# Altium project PROJECT NAME V1.1.PrjPcb
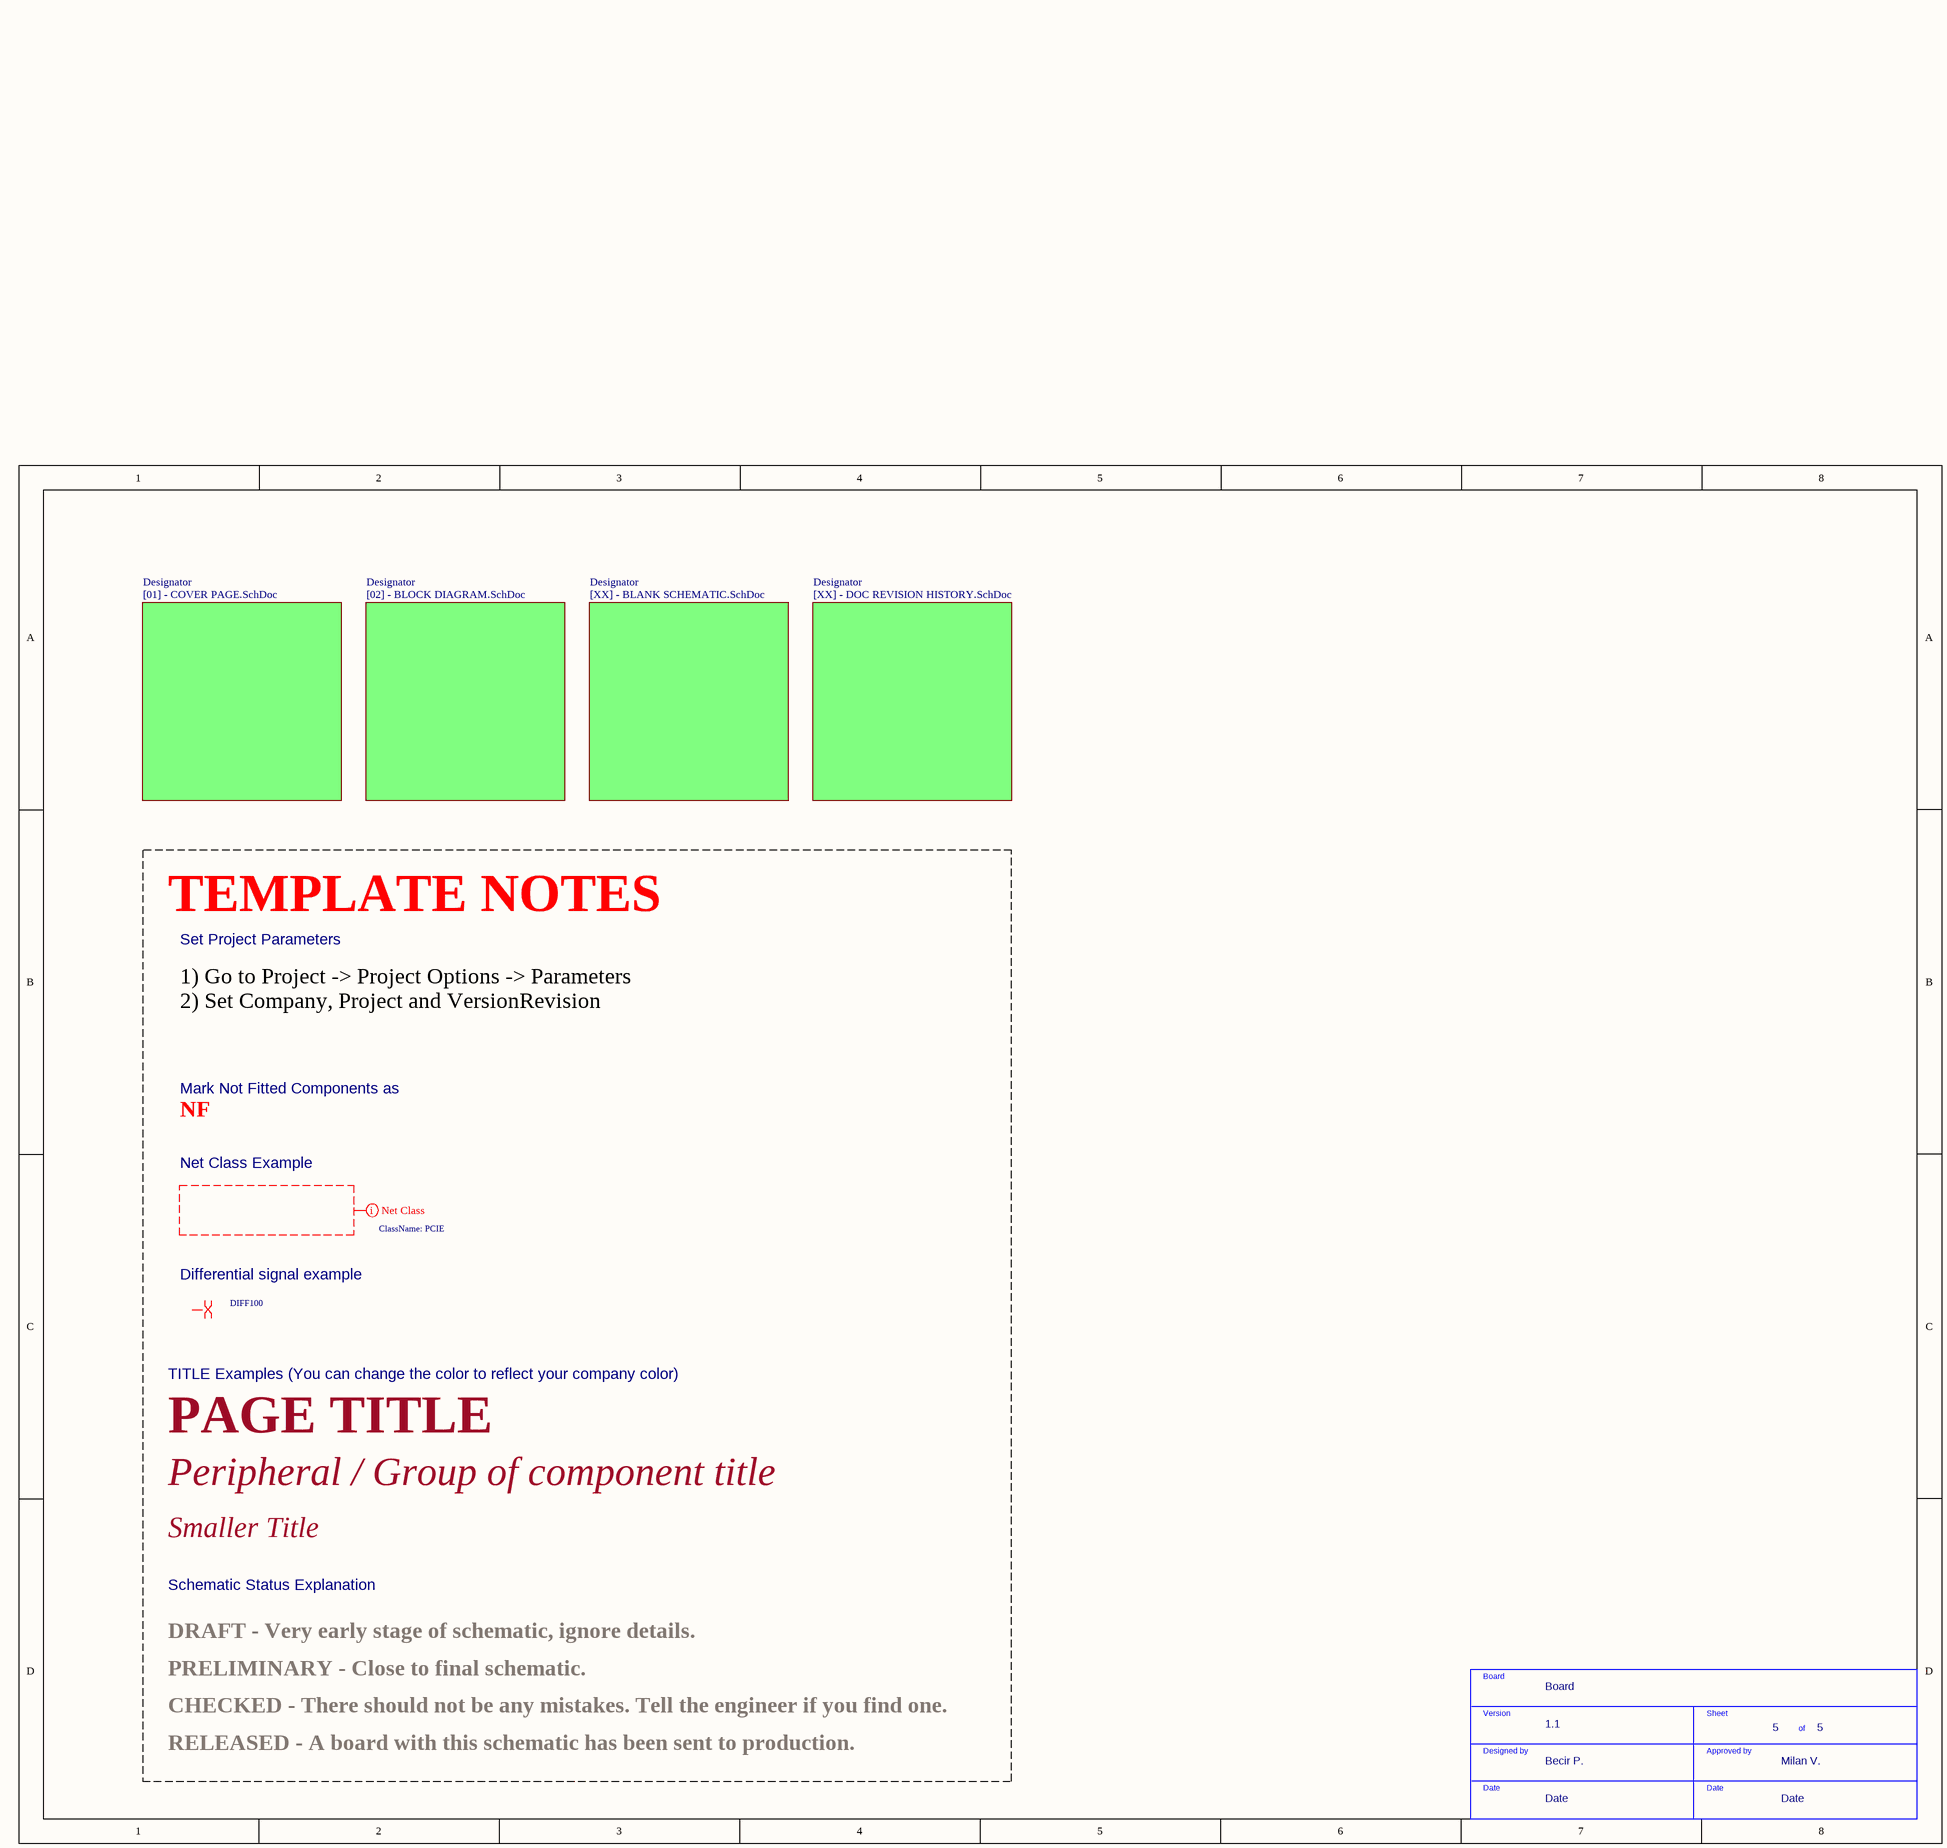
[diagram p0: PROJECT NAME.SchDoc]
Approved: Milan V.; ApprovedDate: Date; Board: Board; Company: IBEKO POWER AB; Designed: Becir P.; DesignedDate: Date; Project: PROJECT NAME; Title: PROJECT NAME V1.1; Version: 1.1
5 sheets, 6 parts. Net scope: global (net labels, ports and power ports of the same name join across sheets).
Board file: PROJECT NAME V1.1.PcbDoc
Sheets:
  PROJECT NAME.SchDoc
    Designator = [01] - COVER PAGE.SchDoc
    Designator = [02] - BLOCK DIAGRAM.SchDoc
    Designator = [XX] - BLANK SCHEMATIC.SchDoc
    Designator = [XX] - DOC REVISION HISTORY.SchDoc

## Sheet PROJECT NAME.SchDoc: PROJECT NAME V1.1
size A3; CompanyName: KDS; Organization: KDS; DocumentNumber: 5; Revision: V1I1; SheetNumber: 5; SheetTotal: 5; PageSetup: Record=PageOptions|CenterHorizontal=True|CenterVertical=True|PrintScale=1.07|XCorrection=1.00|YCorrection=1.00|PrintKind=1|BorderSize=5000000|LeftOffset=0|BottomOffset=0|Orientation=2|PaperLength=1000|PaperWidth=1000|Scale=100|PaperSource=7|PrintQuality=600|MediaType=1|DitherType=10|PaperKind=A3|PrintScaleMode=1; ProjectName: KDS C6A816x Module

### Parts
(Parts that share a designator on the sheet are numbered #1, #2 ... from top to bottom, then left to right.)
STB#1  -  (value not drawn)  (graphical)

### Sub-sheets
Designator = [01] - COVER PAGE.SchDoc: no entries
Designator = [02] - BLOCK DIAGRAM.SchDoc: no entries
Designator = [XX] - BLANK SCHEMATIC.SchDoc: no entries
Designator = [XX] - DOC REVISION HISTORY.SchDoc: no entries

### Layout directives
net class PCIE: (no net found under the mark)
differential pair; net class DIFF100: (no net found under the mark)

### Notes on the sheet
- TEMPLATE NOTES
- Set Project Parameters
- 1) Go to Project -> Project Options -> Parameters
  2) Set Company, Project and VersionRevision
- NF
- Mark Not Fitted Components as
- Net Class Example
- Differential signal example
- TITLE Examples (You can change the color to reflect your company color)
- PAGE TITLE
- Peripheral / Group of component title
- Smaller Title
- Schematic Status Explanation
- PRELIMINARY - Close to final schematic.
- DRAFT - Very early stage of schematic, ignore details.
- CHECKED - There should not be any mistakes. Tell the engineer if you find one.
- RELEASED - A board with this schematic has been sent to production.
- (in symbol Schematic Title Block) Board; Version; Sheet; of; Designed by; Approved by; Date

### Library data of the parts
STB#1 = Schematic Title Block

## Sheet [01] - COVER PAGE.SchDoc: PROJECT NAME V1.1
size A3; DocumentNumber: 1; SheetNumber: 1; SheetTotal: 5
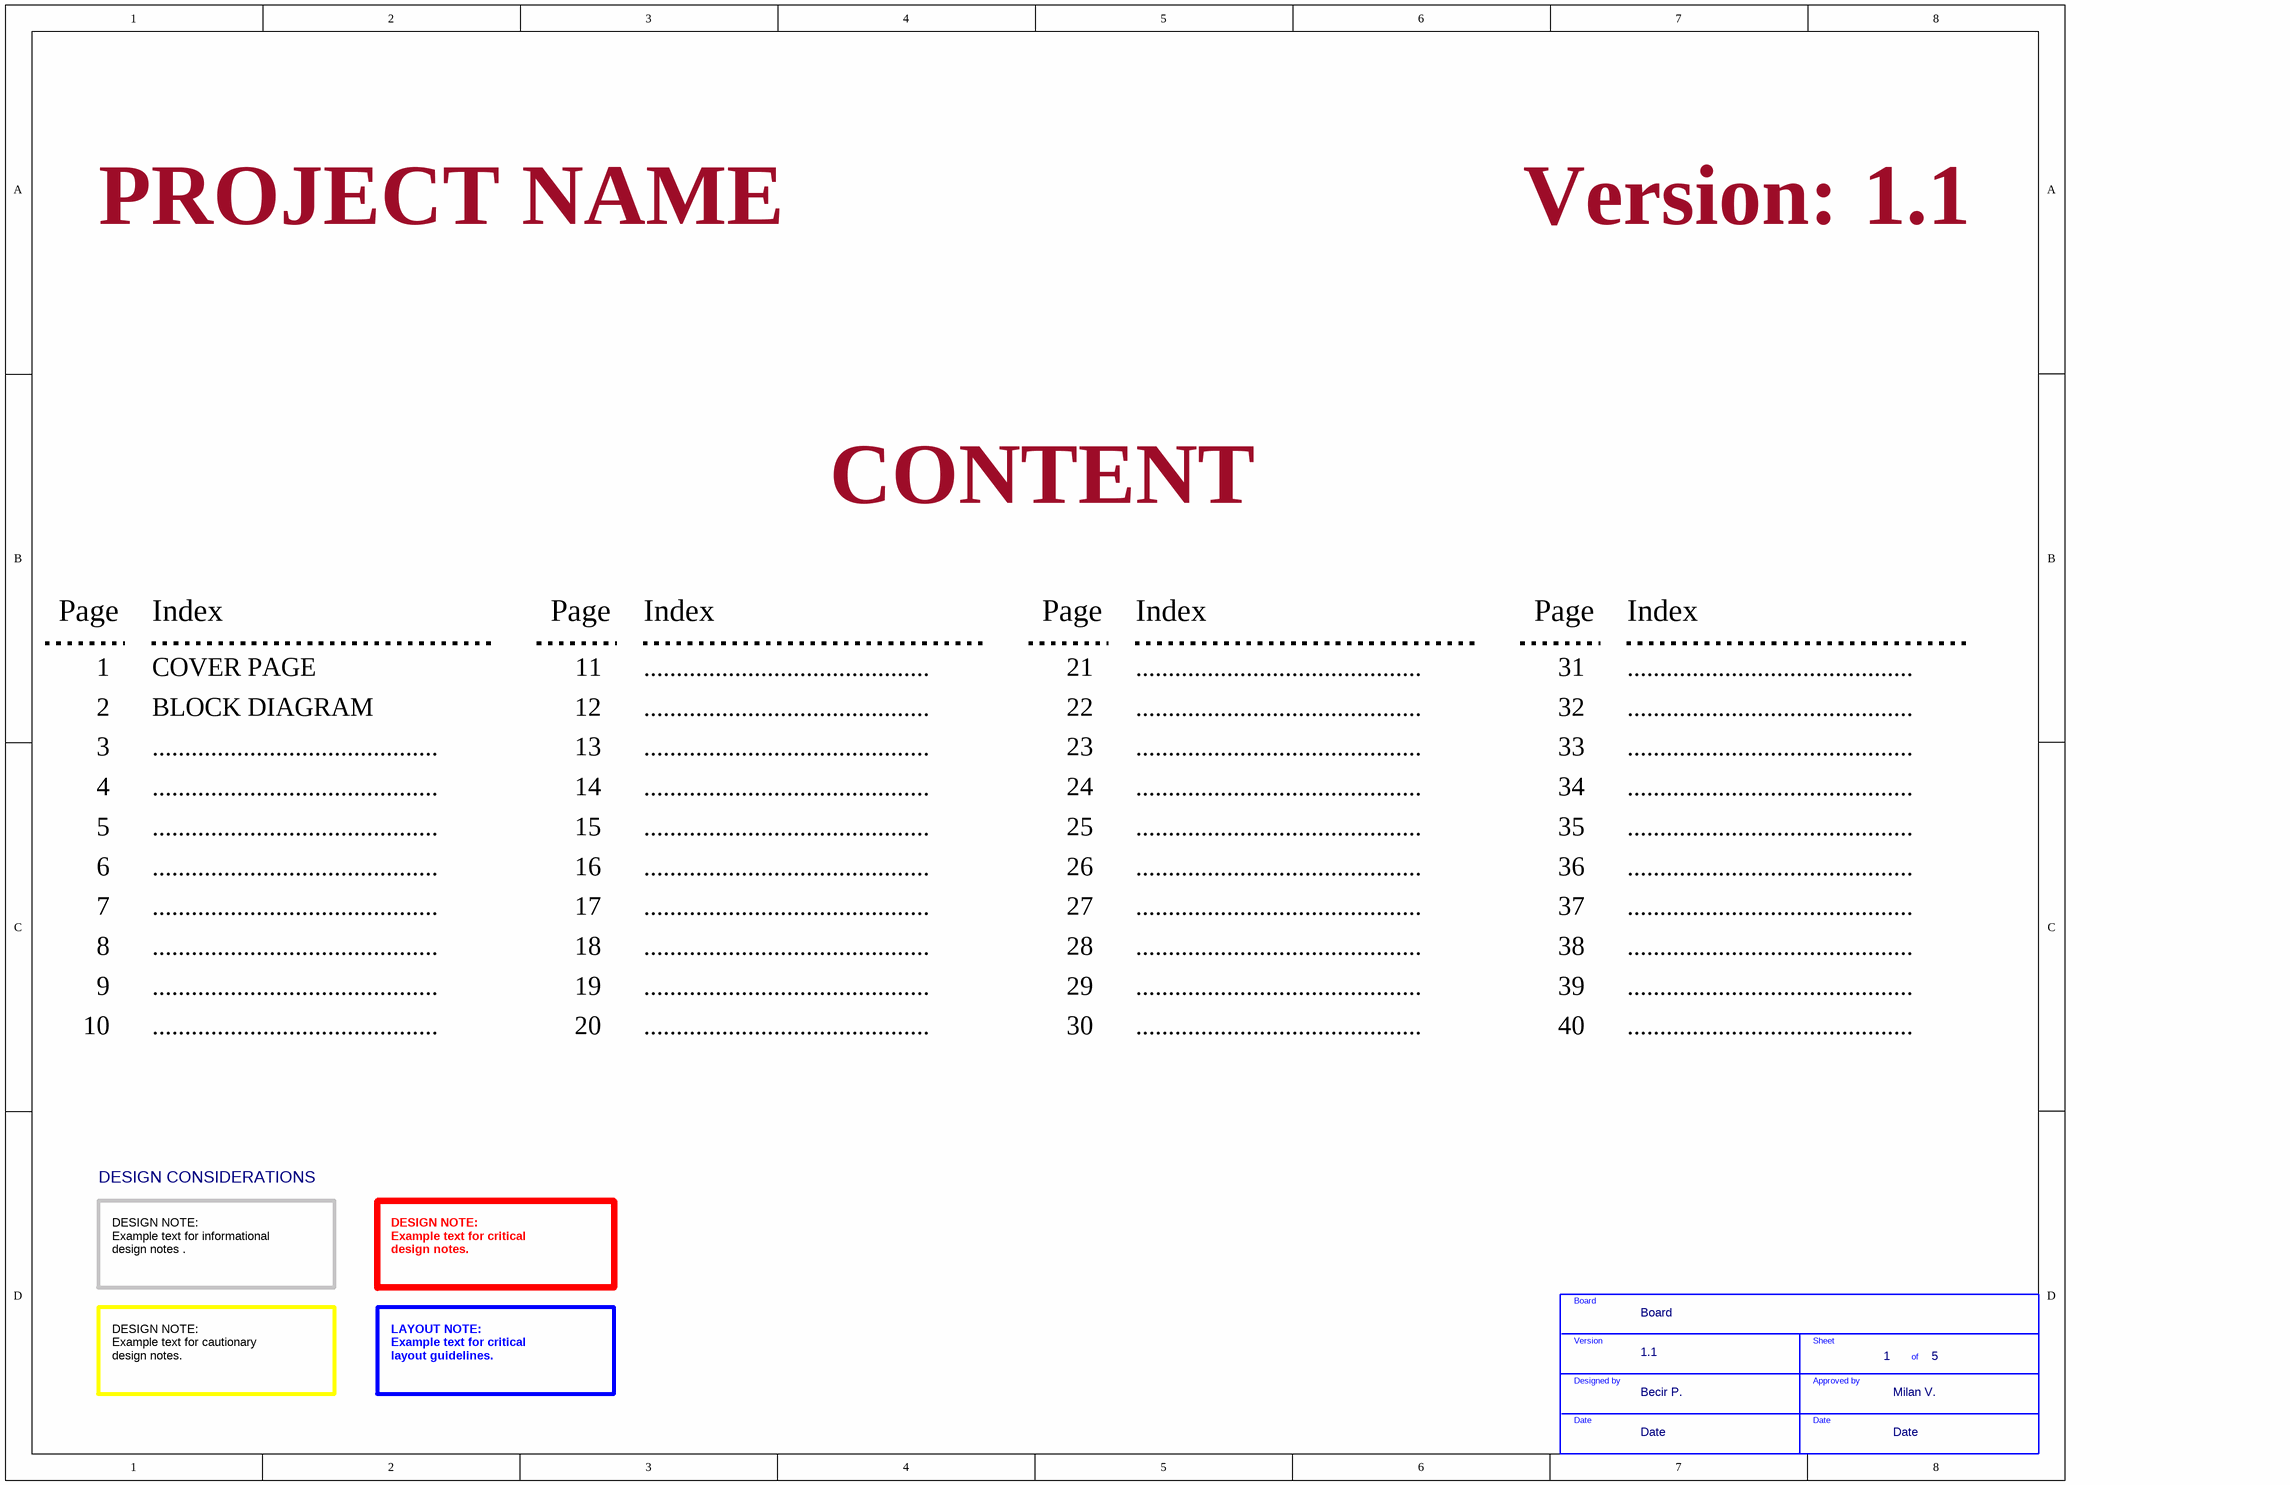
[diagram p1: [01] - COVER PAGE.SchDoc]

### Parts
(Parts that share a designator on the sheet are numbered #1, #2 ... from top to bottom, then left to right.)
STB#2  -  (value not drawn)  (graphical)

### Notes on the sheet
- Version:
- CONTENT
- Page
- Index
- 1
- COVER PAGE
- 11
- ............................................
- 21
- 31
- 2
- 3
- BLOCK DIAGRAM
- 12
- 13
- 22
- 23
- 32
- 33
- 4
- 5
- 14
- 15
- 24
- 25
- 34
- 35
- 6
- 16
- 26
- 36
- 7
- 8
- 17
- 18
- 27
- 28
- 37
- 38
- 9
- 10
- 19
- 20
- 29
- 30
- 39
- 40
- DESIGN CONSIDERATIONS
- DESIGN NOTE:
  Example text for informational
  design notes .
- DESIGN NOTE:
  Example text for critical
  design notes.
- DESIGN NOTE:
  Example text for cautionary
  design notes.
- LAYOUT NOTE:
  Example text for critical
  layout guidelines.
- (in symbol Schematic Title Block) Board; Version; Sheet; of; Designed by; Approved by; Date

### Library data of the parts
STB#2 = Schematic Title Block

## Sheet [02] - BLOCK DIAGRAM.SchDoc: PROJECT NAME V1.1
size A3; DocumentNumber: 2; SheetNumber: 2; SheetTotal: 5
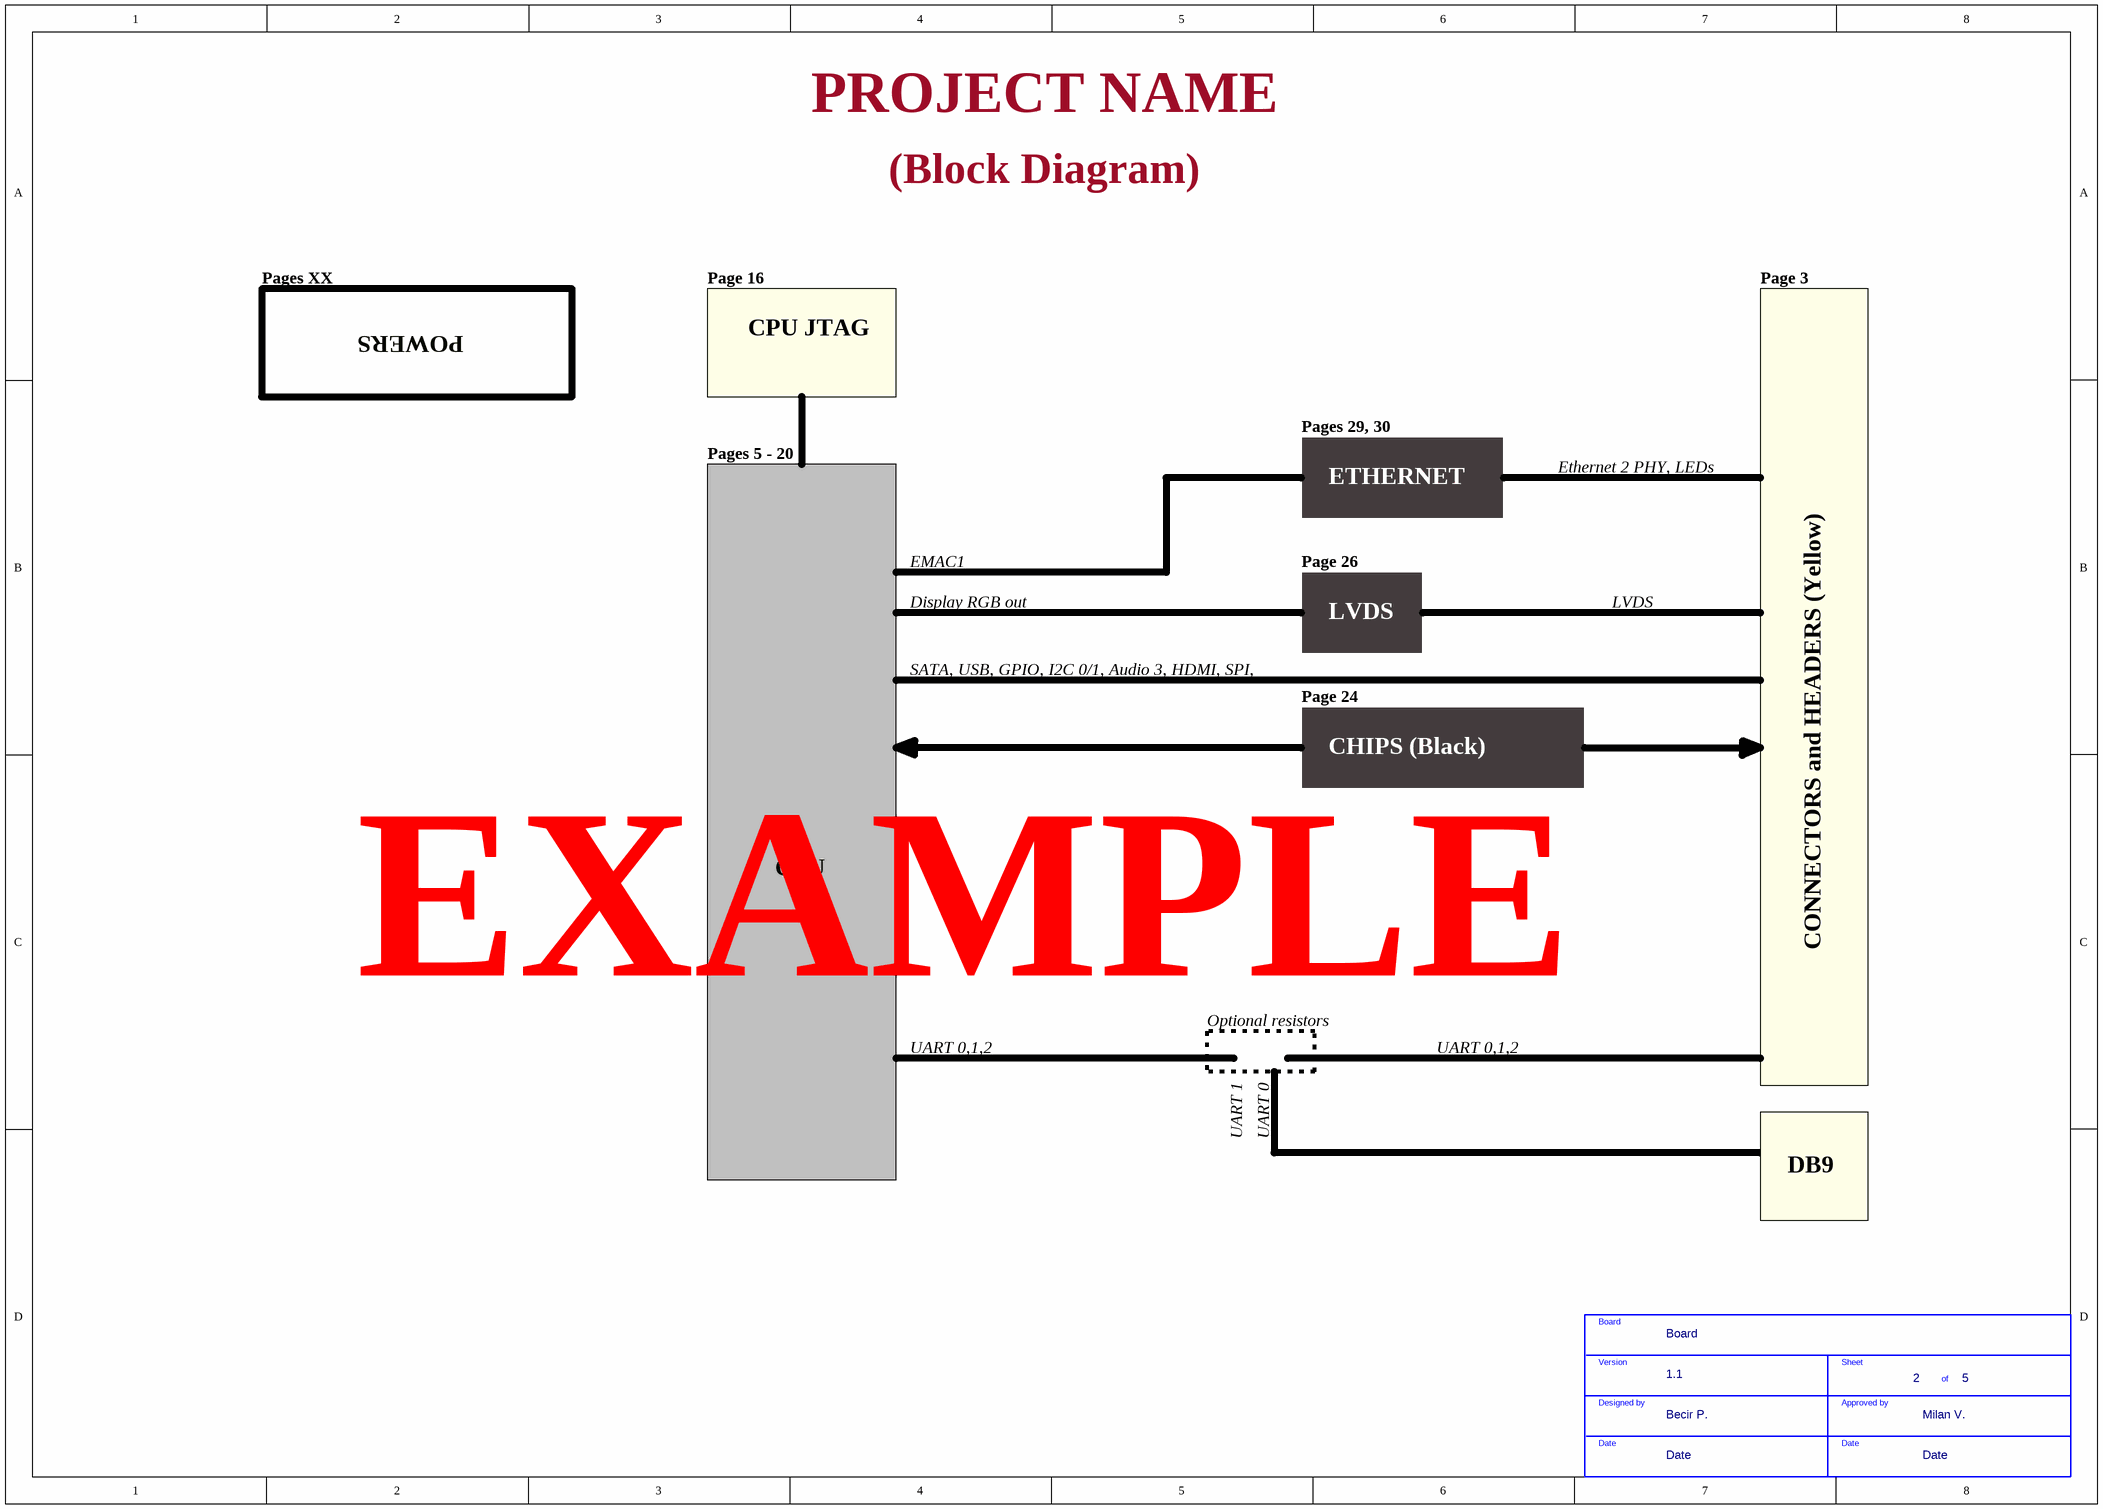
[diagram p2: [02] - BLOCK DIAGRAM.SchDoc]

### Parts
(Parts that share a designator on the sheet are numbered #1, #2 ... from top to bottom, then left to right.)
STB#3  -  (value not drawn)  (graphical)

### Notes on the sheet
- (Block Diagram)
- Pages XX
- Page 16
- Page 3
- POWERS
- CPU JTAG
- Pages 29, 30
- Pages 5 - 20
- ETHERNET
- Ethernet 2 PHY, LEDs
- EMAC1
- Page 26
- Display RGB out
- LVDS
- SATA, USB, GPIO, I2C 0/1, Audio 3, HDMI, SPI,
- Page 24
- CHIPS (Black)
- CPU
- CONNECTORS and HEADERS (Yellow)
- EXAMPLE
- UART 0,1,2
- Optional resistors
- FPGA
- UART 1
- UART 0
- DB9
- CLOCKS (CPU & PCIE)
- (in symbol Schematic Title Block) Board; Version; Sheet; of; Designed by; Approved by; Date

### Library data of the parts
STB#3 = Schematic Title Block

## Sheet [XX] - BLANK SCHEMATIC.SchDoc: PROJECT NAME V1.1
size A3; DocumentNumber: 3; SheetNumber: 3; SheetTotal: 5
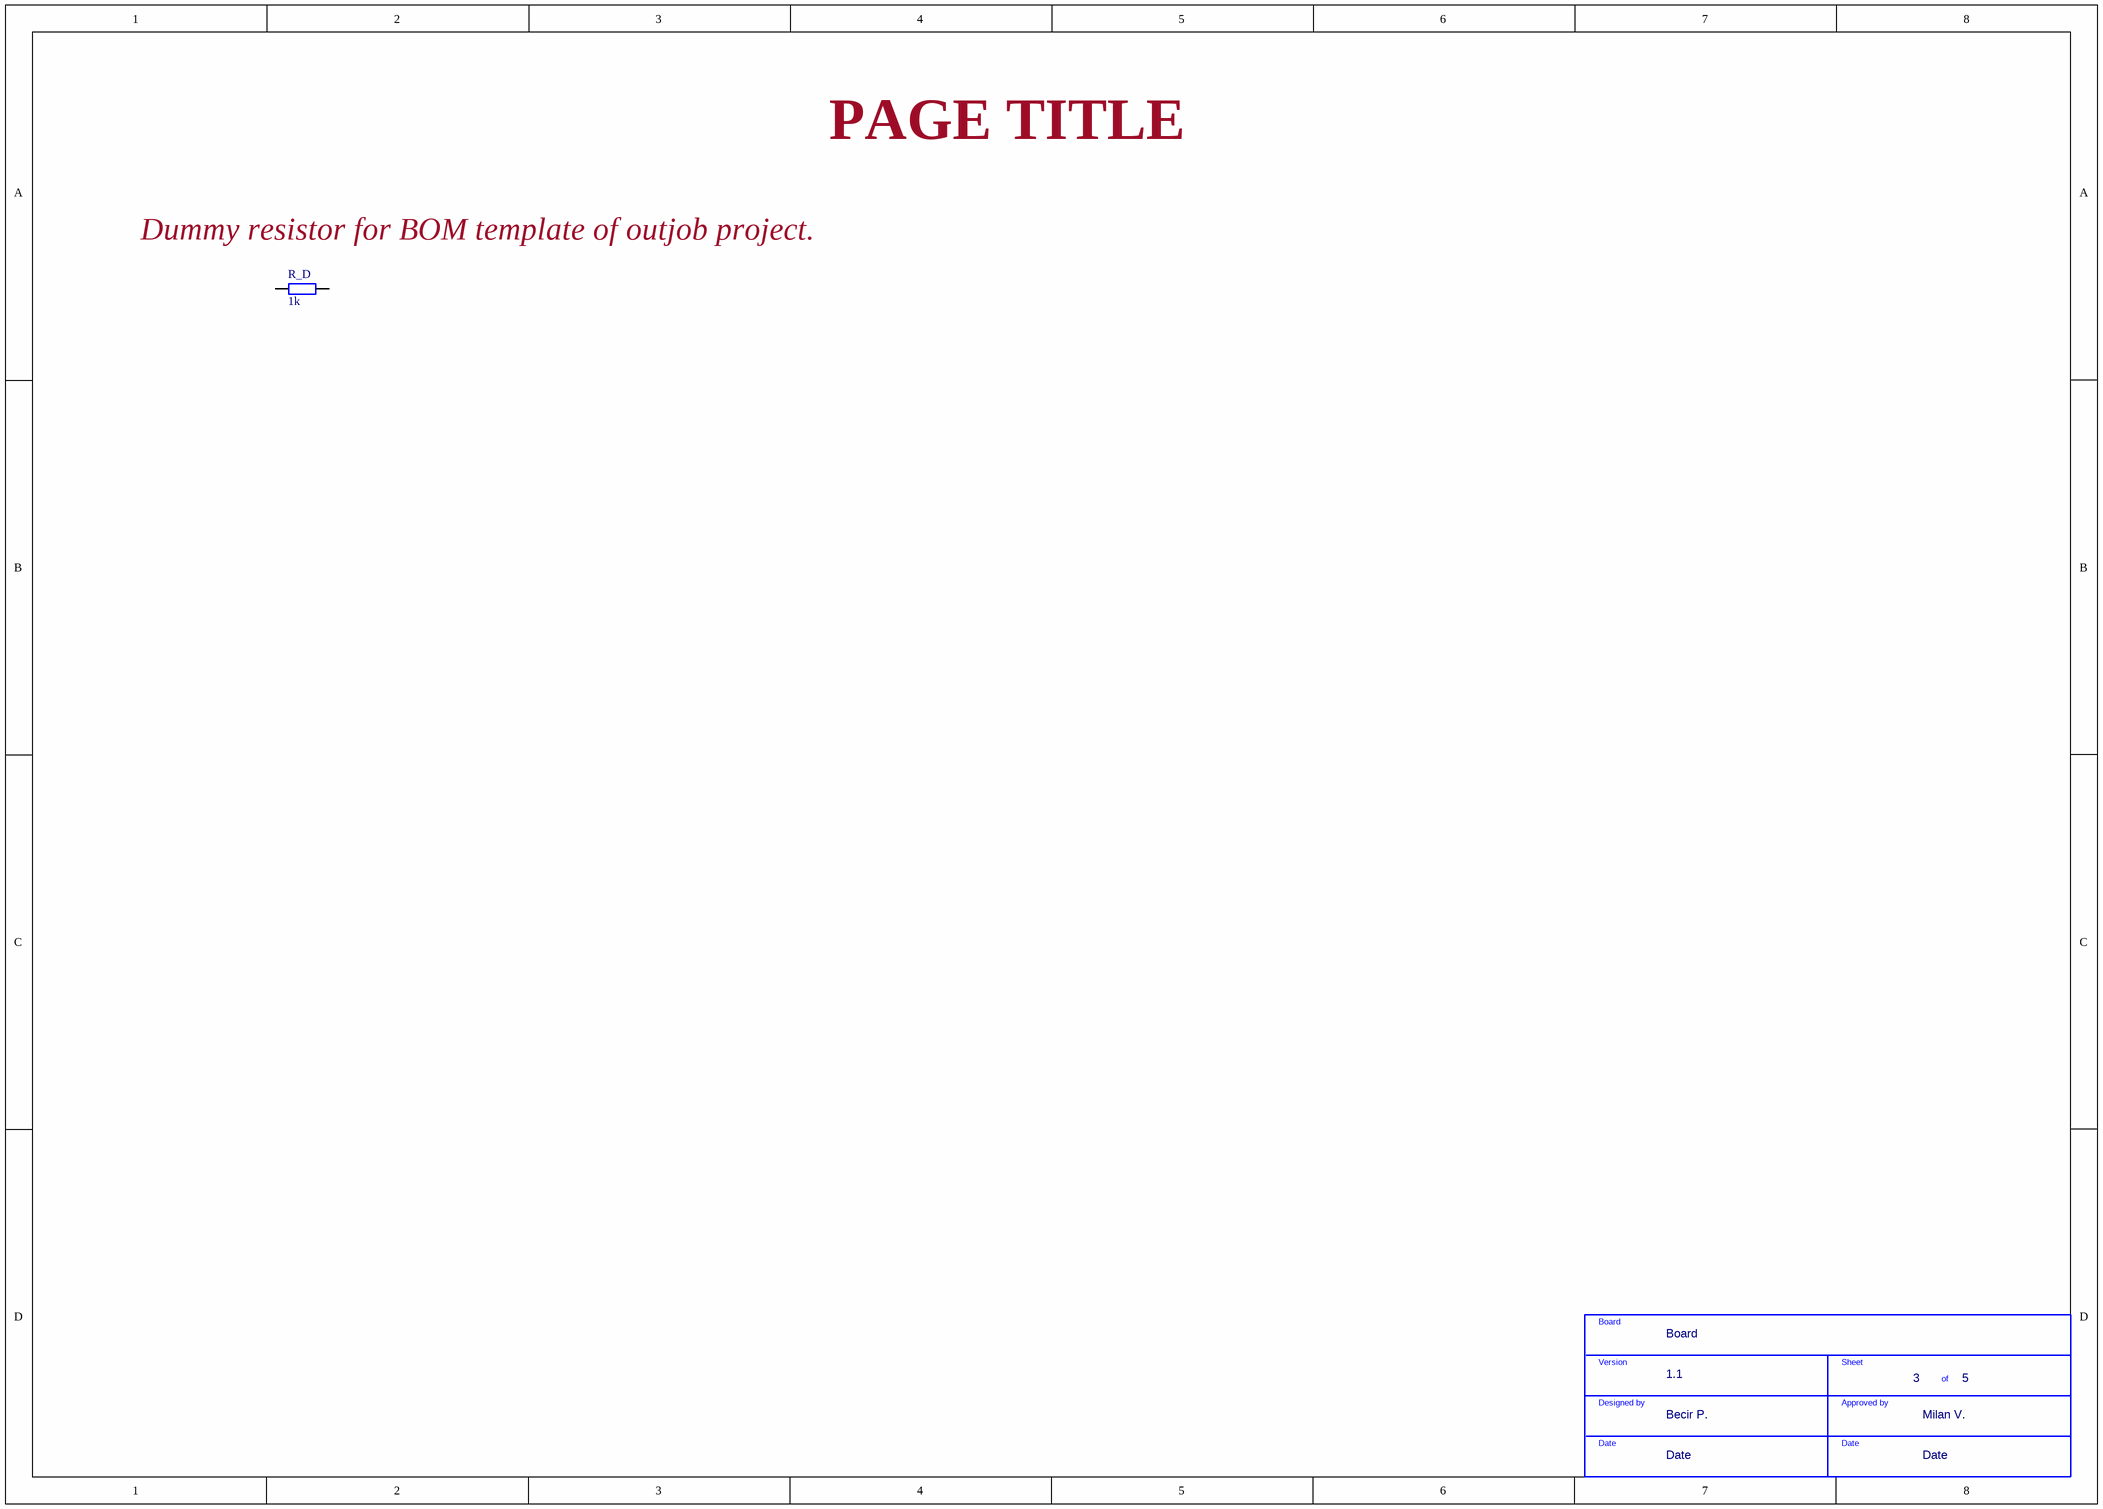
[diagram p3: [XX] - BLANK SCHEMATIC.SchDoc]

### Parts
(Parts that share a designator on the sheet are numbered #1, #2 ... from top to bottom, then left to right.)
R_D  1k  [R0805]
STB#4  -  (value not drawn)  (graphical)

### Nets

Not connected (* = marked no-connect by the designer): R_D 1 2

### Notes on the sheet
- PAGE TITLE
- (near R_D) Dummy resistor for BOM template of outjob project.
- CLOCKS (CPU & PCIE)
- (in symbol Schematic Title Block) Board; Version; Sheet; of; Designed by; Approved by; Date

### Library data of the parts
R_D = CRCW08051K00FKEA: RES 1K 0805 0.125W; Manufacturer: Vishay Dale; Tolerance: ±1%; Power (Watts): 0.125W, 1/8W; Temperature Coefficient: ±100ppm/°C; .PCBChecked: BP; Supplier 1: Avnet Abacus; Manufacturer Part Number: CRCW08051K00FKEA; RoHS: RoHS Compliant; Category: Resistors; Stock 1: 528553; Pricing 1: 1=0.1, 10=0.042, 25=0.0304, 50=0.0232, 100=0.017, 250=0.013, 500=0.0104, 1000=0.00765 (USD); Packaging: Cut Tape (CT); Part Status: Active; Resistance (Ohms): 1k; Composition: Thick Film; Features: Automotive AEC-Q200; Operating Temperature: -55°C ~ 155°C; Package: 0805 (2012 Metric); Supplier Device Package: 0805; Size / Dimension: 0.079" L x 0.049" W (2.00mm x 1.25mm); Height - Seated (Max): 0.020" (0.50mm); Failure Rate: -; ComponentLink1URL: http://www.vishay.com/docs/20035/dcrcwe3.pdf; ComponentLink1Description: Datasheet; Supplier Part Number 1: CRCW08051K00FKEA; Type: SMD; .SCHChecked: BP
STB#4 = Schematic Title Block

## Sheet [XX] - DOC REVISION HISTORY.SchDoc: PROJECT NAME V1.1
size A3; DocumentNumber: 4; SheetNumber: 4; SheetTotal: 5
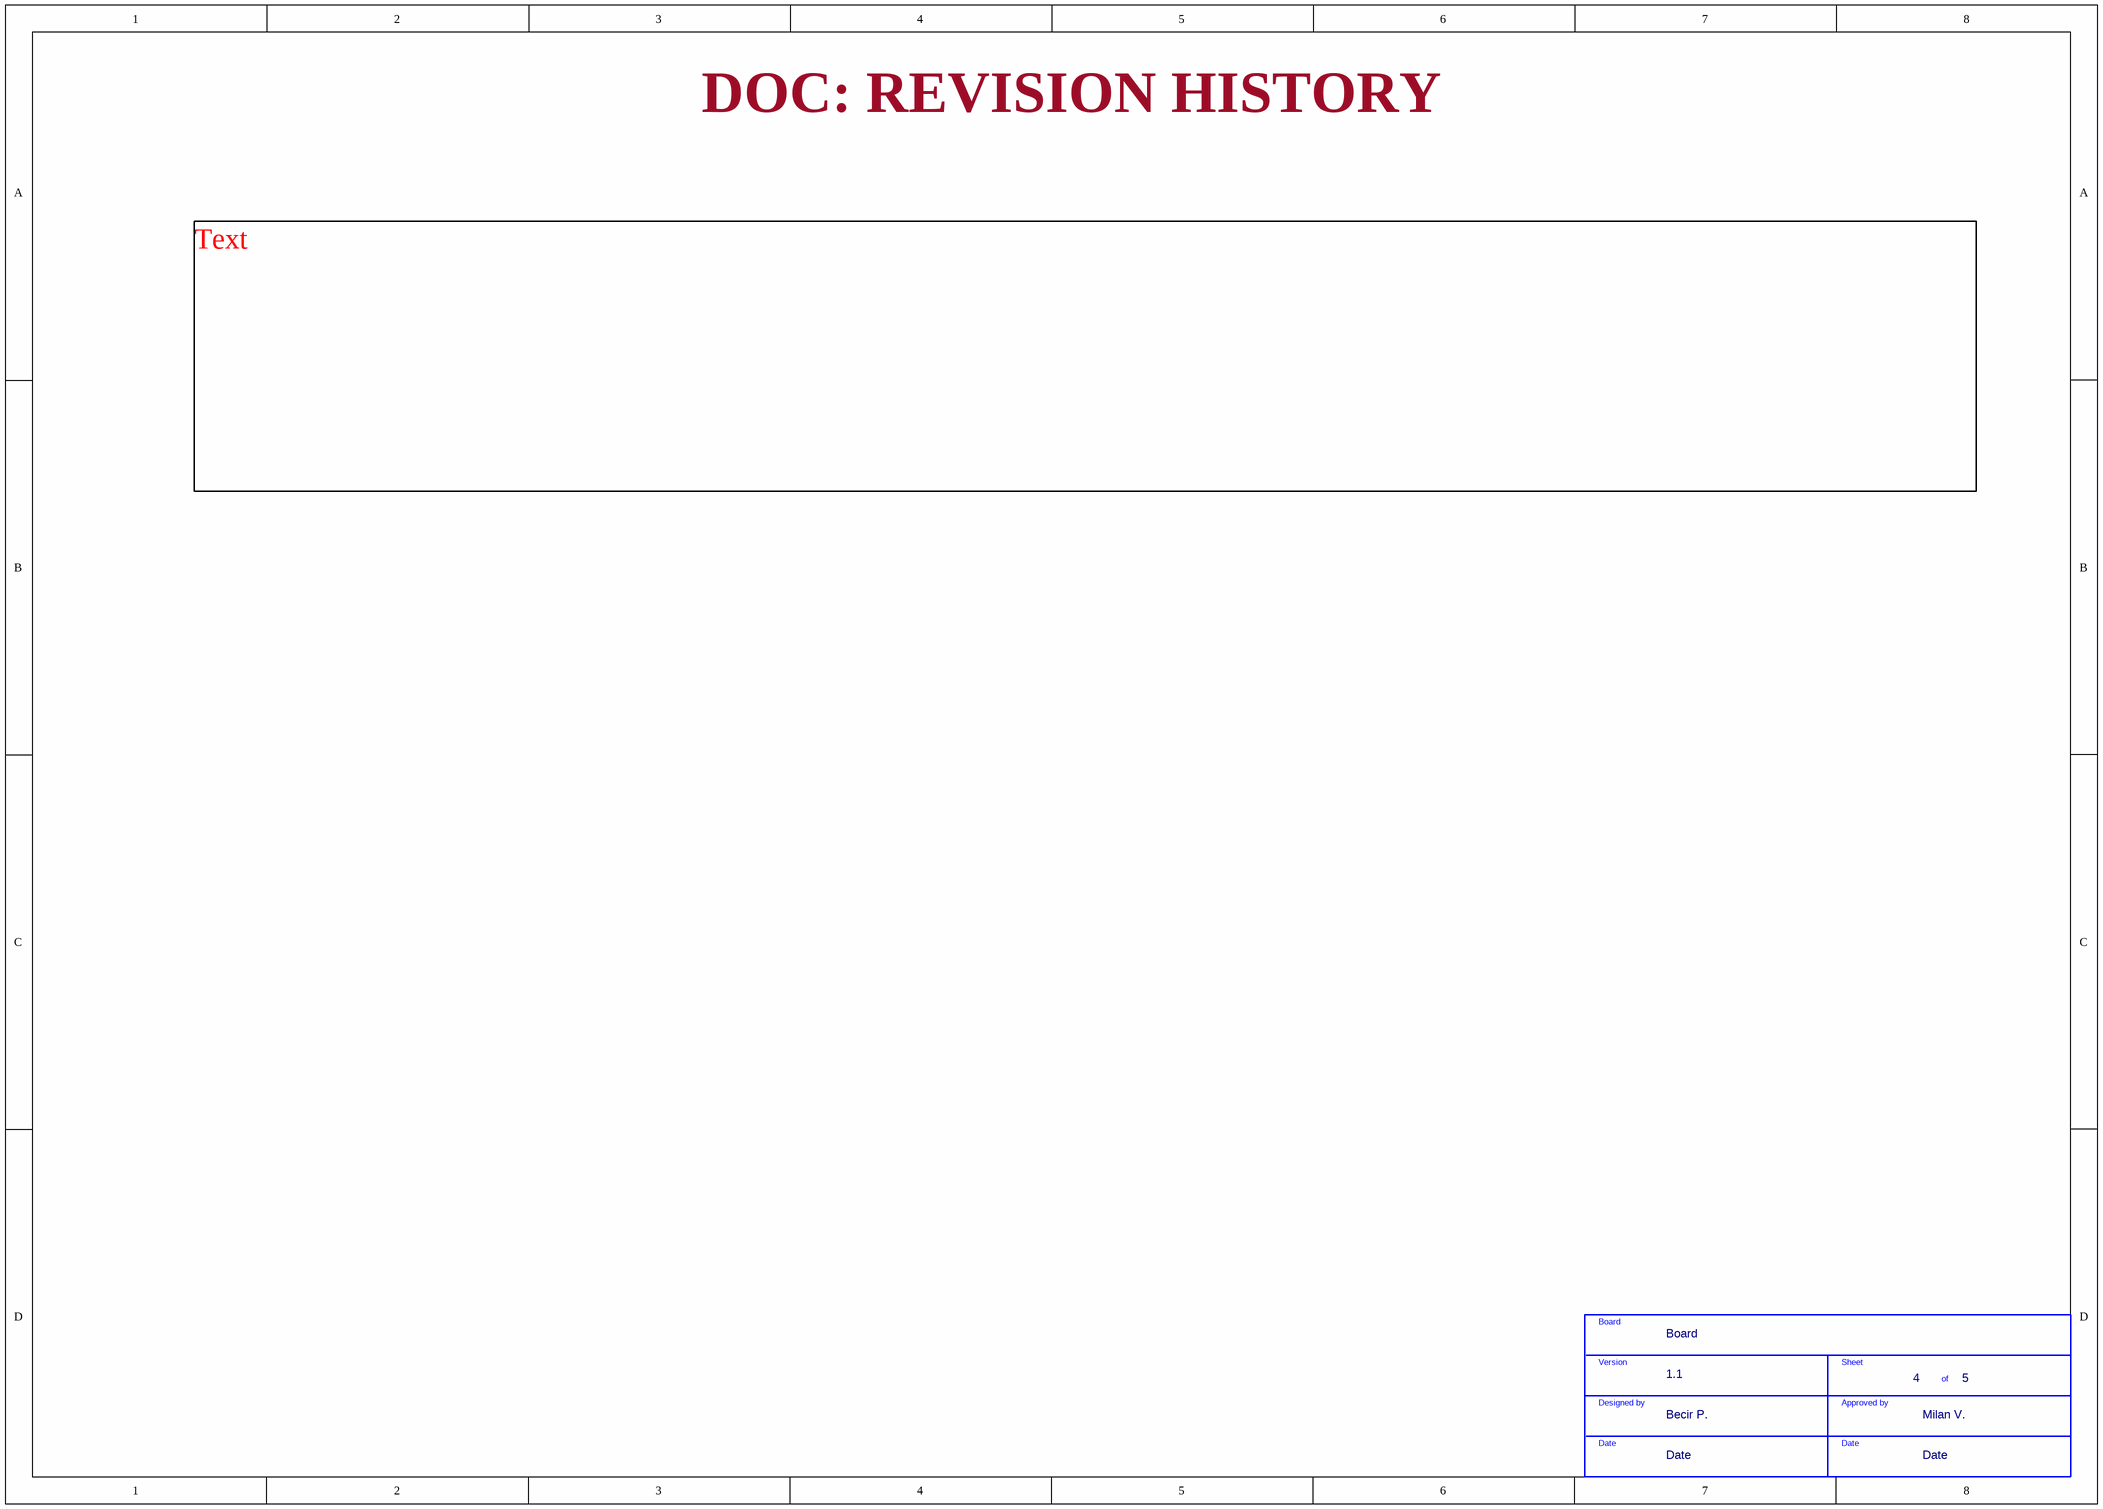
[diagram p4: [XX] - DOC REVISION HISTORY.SchDoc]

### Parts
(Parts that share a designator on the sheet are numbered #1, #2 ... from top to bottom, then left to right.)
STB#5  -  (value not drawn)  (graphical)

### Notes on the sheet
- DOC: REVISION HISTORY
- Text
- CLOCKS (CPU & PCIE)
- (in symbol Schematic Title Block) Board; Version; Sheet; of; Designed by; Approved by; Date

### Library data of the parts
STB#5 = Schematic Title Block